# EAGLE design Ver4 (EAGLE 9.6.2)
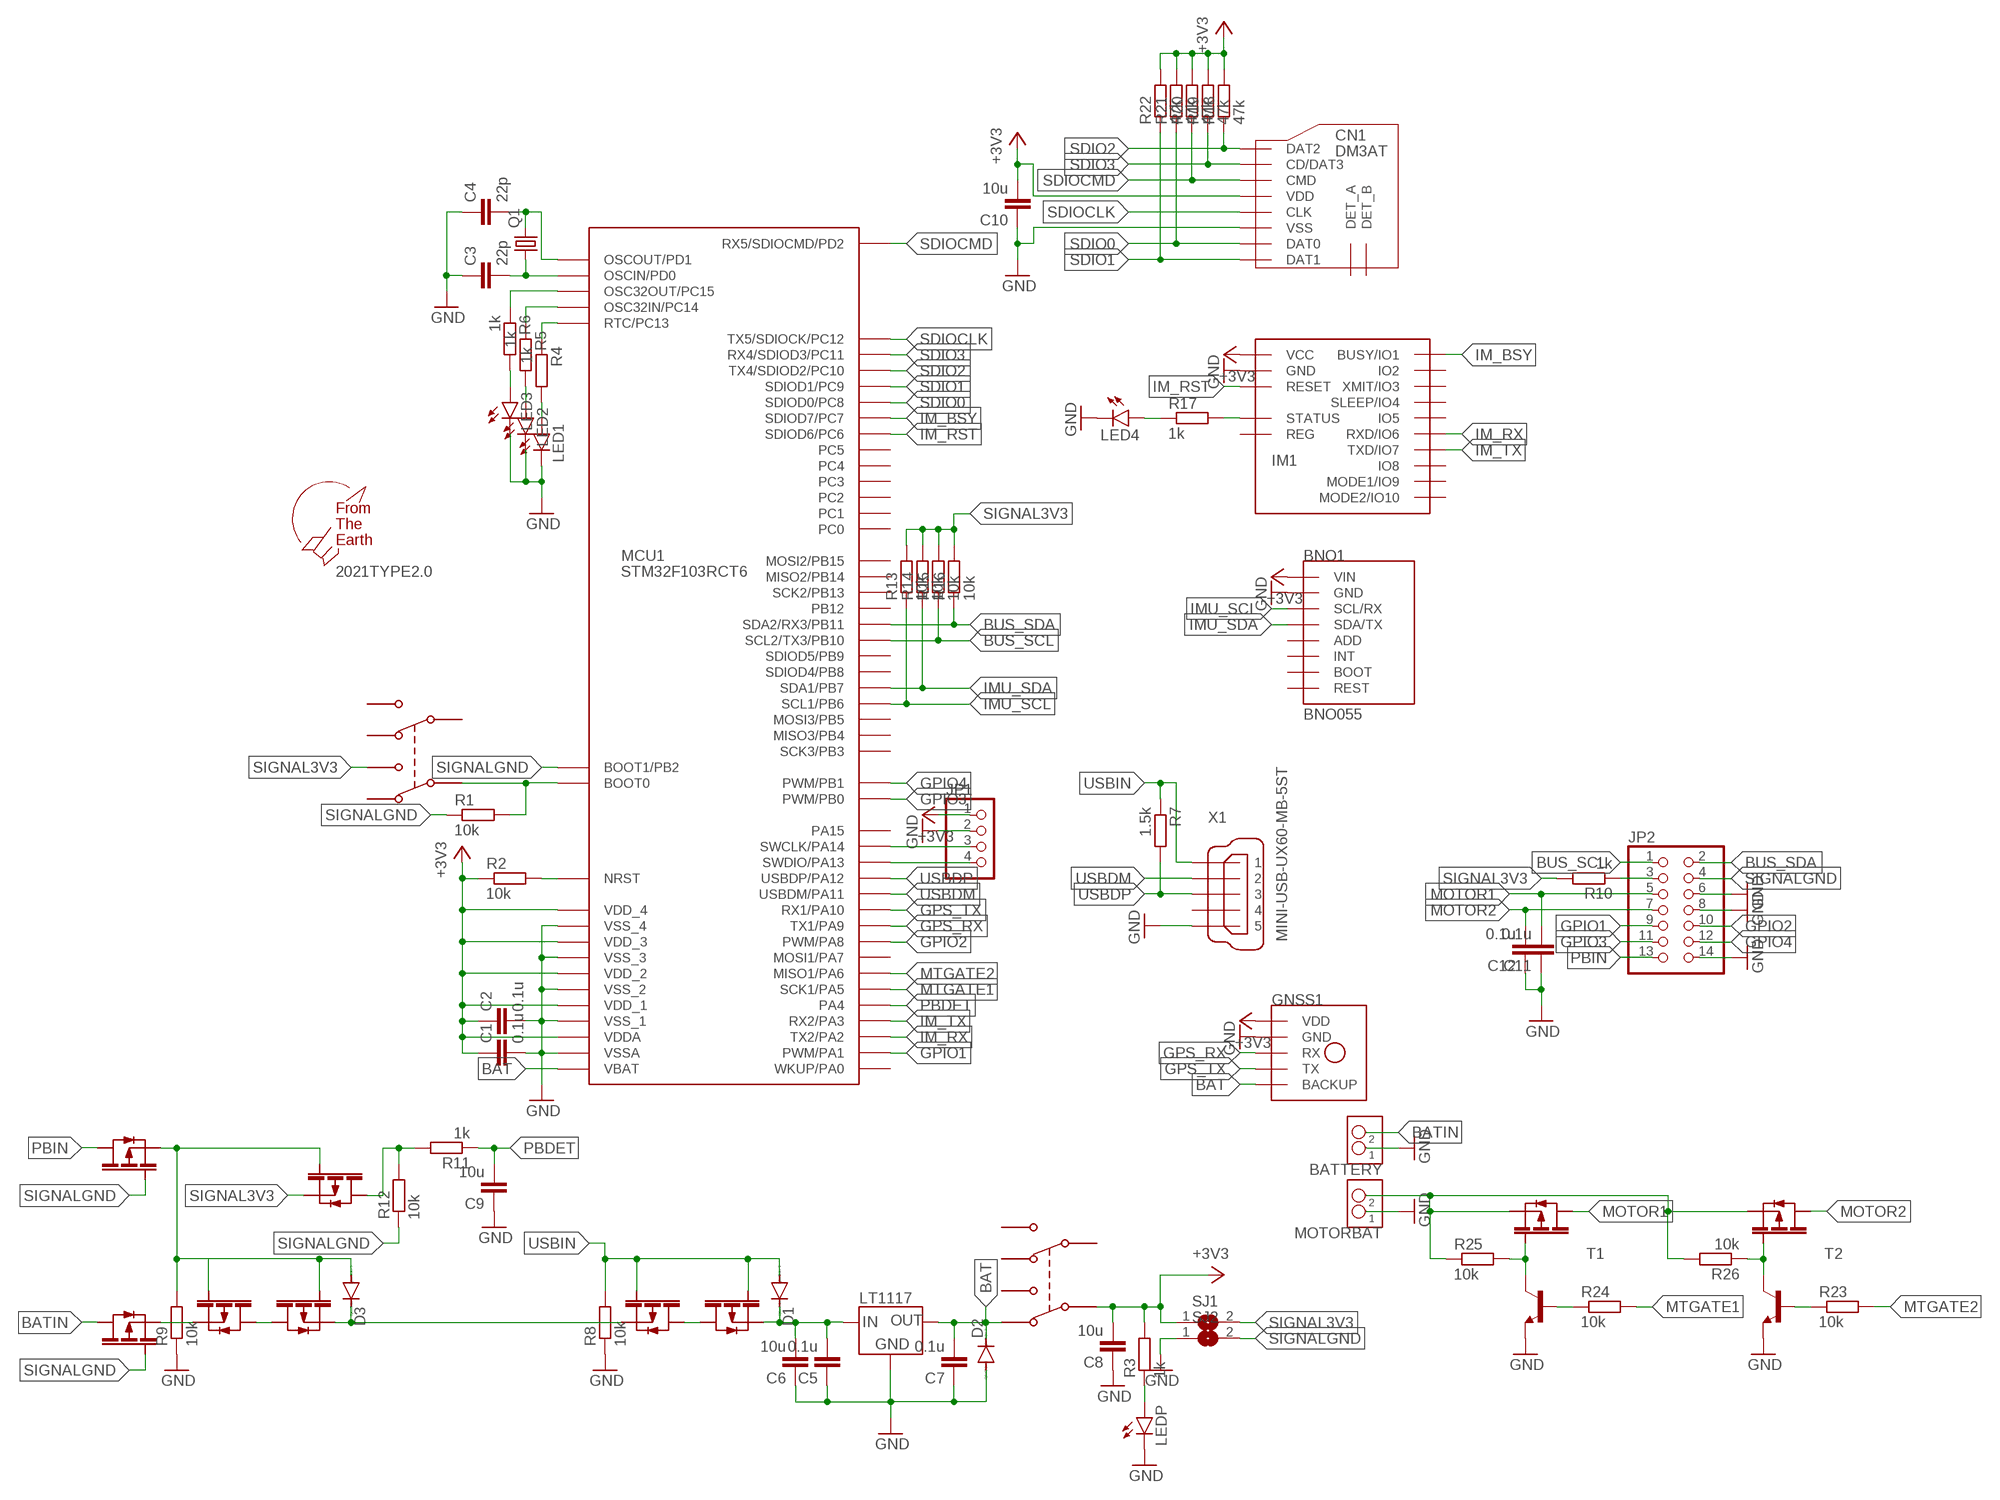
[diagram p0: schematic, sheet 1]

## Parts
2021TYPE2.0  F.T.E.LOGO  [LOGO]
BATTERY  S2B-XH-A  [S2B-XH-A]
BNO1  BNO055  [BNO055]
C1  0.1u  C-EUC1608  [C1608]
C2  0.1u  C-EUC1608  [C1608]
C3  22p  C-EUC1608  [C1608]
C4  22p  C-EUC1608  [C1608]
C5  0.1u  C-EUC1608  [C1608]
C6  10u  C-EUC1608  [C1608]
C7  0.1u  C-EUC1608  [C1608]
C8  10u  C-EUC1608  [C1608]
C9  10u  C-EUC1608  [C1608]
C10  10u  C-EUC1608  [C1608]
C11  0.1u  C-EUC1608  [C1608]
C12  0.1u  C-EUC1608  [C1608]
CN1  DM3AT  [DM3AT]
D1  DIODE-SOD123  [SOD123]
D2  DIODE-SOD123  [SOD123]
D3  DIODE-SOD123  [SOD123]
FET1  PCH  [SOT-23]
FET2  PCH  [SOT-23]
FET3  PCH  [SOT-23]
FET4  PCH  [SOT-23]
FET5  PCH  [SOT-23]
FET6  PCH  [SOT-23]
FET7  PCH  [SOT-23]
FET8  PCH  [SOT-23]
FET9  PCH  [SOT-23]
GNSS1  GYSFDMAXB  [GYSFDMAXB]
IC1  LT1117-3.3  [SOT-223]
IM1  IM920C  [IM920C]
JP1  PINHD-1X4/90  [1X04/90]
JP2  PINHD-2X7  [2X07]
LED1  LEDSML0805  [SML0805]
LED2  LEDSML0805  [SML0805]
LED3  LEDSML0805  [SML0805]
LED4  LEDSML0805  [SML0805]
LEDP  LEDSML0805  [SML0805]
MCU1  STM32F103RCT6  [LQFP64]
MOTORBAT  S2B-XH-A  [S2B-XH-A]
Q1  CRYSTALHC49S  [HC49/S]
R1  10k  R-EU_R0805  [R0805]
R2  10k  R-EU_R0805  [R0805]
R3  1k  R-EU_R0805  [R0805]
R4  1k  R-EU_R0805  [R0805]
R5  1k  R-EU_R0805  [R0805]
R6  1k  R-EU_R0805  [R0805]
R7  1.5k  R-EU_R0805  [R0805]
R8  10k  R-EU_R0805  [R0805]
R9  10k  R-EU_R0805  [R0805]
R10  1k  R-EU_R0805  [R0805]
R11  1k  R-EU_R0805  [R0805]
R12  10k  R-EU_R0805  [R0805]
R13  10k  R-EU_R0805  [R0805]
R14  10k  R-EU_R0805  [R0805]
R15  10k  R-EU_R0805  [R0805]
R16  10k  R-EU_R0805  [R0805]
R17  1k  R-EU_R0805  [R0805]
R18  47k  R-EU_R0805  [R0805]
R19  47k  R-EU_R0805  [R0805]
R20  47k  R-EU_R0805  [R0805]
R21  47k  R-EU_R0805  [R0805]
R22  47k  R-EU_R0805  [R0805]
R23  10k  R-EU_R0805  [R0805]
R24  10k  R-EU_R0805  [R0805]
R25  10k  R-EU_R0805  [R0805]
R26  10k  R-EU_R0805  [R0805]
SJ1  SJ  [SJ]
SJ2  SJ  [SJ]
T1  -NPN-SOT23-EBC  [SOT23-EBC]
T2  -NPN-SOT23-EBC  [SOT23-EBC]
U$1  MSS22D18  [MSS22D18]
U$2  MSS22D18  [MSS22D18]
X1  MINI-USB-UX60-MB-5ST  [UX60-MB-5ST]

## Nets
+3V3 [POWER_L]: BNO1.P1(VIN) C1.1 C2.1 C8.2 C10.2 CN1.VDD GNSS1.P$16(VDD) IM1.$P17(VCC) JP1.1 MCU1.P$13(VDDA) MCU1.P$19(VDD_4) MCU1.P$32(VDD_1) MCU1.P$48(VDD_2) MCU1.P$64(VDD_3) R2.1 R3.2 R18.2 R19.2 R20.2 R21.2 R22.2 SJ1.1 U$2.P$4
BAT [SIGNAL]: C7.2 D2.C GNSS1.P$14(BACKUP) IC1.1(OUT) IC1.2(OUT) MCU1.P$1(VBAT) U$2.P$3
BAT_FET_FET1 [POWER_L]: FET3.P$2 FET5.P$2
BAT_FET_FET2 [POWER_L]: FET3.P$3 FET4.P$3
BATIN [POWER_L]: BATTERY.P$2 FET5.P$3
BOOT0 [SIGNAL]: MCU1.P$60(BOOT0) R1.2 U$1.P$4
BUS_3V3 [SIGNAL]: JP2.3 R10.1
BUS_SCL [SIGNAL]: JP2.1 MCU1.P$29(SCL2/TX3/PB10) R15.1
BUS_SDA [SIGNAL]: JP2.2 MCU1.P$30(SDA2/RX3/PB11) R16.1
DIODE_FET [POWER_L]: D3.C FET1.P$2 FET4.P$2
FET_REG [POWER_L]: C5.2 C6.2 D1.C FET2.P$2 IC1.3(IN)
GND [POWER_L]: BATTERY.P$1 BNO1.P2(GND) C1.2 C2.2 C3.1 C4.1 C5.1 C6.1 C7.1 C8.1 C9.1 C10.1 C11.1 C12.1 CN1.VSS D2.A GNSS1.P$1(GND) GNSS1.P$2(GND) GNSS1.P$7(GND) GNSS1.P$10(GND) GNSS1.P$12(GND) GNSS1.P$19(GND) GNSS1.P$20(GND) IC1.4(GND) IM1.$P18(GND) JP1.2 JP2.6 JP2.8 JP2.14 LED1.C LED2.C LED3.C LED4.C LEDP.C MCU1.P$12(VSSA) MCU1.P$18(VSS_4) MCU1.P$31(VSS_1) MCU1.P$47(VSS_2) MCU1.P$63(VSS_3) MOTORBAT.P$1 R8.1 R9.1 SJ2.1 T2.E X1.5
GPIO1 [GPIO]: JP2.9 MCU1.P$15(PWM/PA1)
GPIO2 [GPIO]: JP2.10 MCU1.P$41(PWM/PA8)
GPIO3 [GPIO]: JP2.11 MCU1.P$26(PWM/PB0)
GPIO4 [GPIO]: JP2.12 MCU1.P$27(PWM/PB1)
GPS_RX [SIGNAL]: GNSS1.P$3(RX) MCU1.P$42(TX1/PA9)
GPS_TX [SIGNAL]: GNSS1.P$5(TX) MCU1.P$43(RX1/PA10)
IM_BSY [SIGNAL]: IM1.$P1(BUSY/IO1) MCU1.P$38(SDIOD7/PC7)
IM_RST [SIGNAL]: IM1.$P19(RESET) MCU1.P$37(SDIOD6/PC6)
IM_RX [SIGNAL]: IM1.$P6(RXD/IO6) MCU1.P$16(TX2/PA2)
IM_ST_R [GPIO]: IM1.$P15(STATUS) R17.2
IM_TX [SIGNAL]: IM1.$P7(TXD/IO7) MCU1.P$17(RX2/PA3)
IMU_SCL [SIGNAL]: BNO1.P3(SCL/RX) MCU1.P$58(SCL1/PB6) R13.1
IMU_SDA [SIGNAL]: BNO1.P4(SDA/TX) MCU1.P$59(SDA1/PB7) R14.1
MOTOR1 [POWER_H]: C11.2 FET9.P$3 JP2.5
MOTOR2 [POWER_H]: C12.2 FET8.P$3 JP2.7
MTBATIN [POWER_H]: FET8.P$2 FET9.P$2 MOTORBAT.P$2 R25.1 R26.2
MTGATE1 [SIGNAL]: MCU1.P$21(SCK1/PA5) R24.2
MTGATE2 [SIGNAL]: MCU1.P$22(MISO1/PA6) R23.2
NRST [SIGNAL]: MCU1.P$7(NRST) R2.2
OSCIN [SIGNAL]: C3.2 MCU1.P$5(OSCIN/PD0) Q1.1
OSCOUT [SIGNAL]: C4.2 MCU1.P$6(OSCOUT/PD1) Q1.2
PB_FET_DIODE [POWER_L]: D3.A FET3.P$1 FET4.P$1 FET6.P$2 FET7.P$1 R9.2
PBDET [SIGNAL]: C9.2 MCU1.P$20(PA4) R11.1
PBDET_FET_R [SIGNAL]: FET7.P$3 R11.2 R12.2
PBIN [POWER_L]: FET6.P$3 JP2.13
PC13_R [GPIO]: MCU1.P$2(RTC/PC13) R4.1
PC14_R [GPIO]: MCU1.P$3(OSC32IN/PC14) R5.1
PC15_R [GPIO]: MCU1.P$4(OSC32OUT/PC15) R6.1
R_LED1 [GPIO]: LED1.A R4.2
R_LED2 [GPIO]: LED2.A R5.2
R_LED3 [GPIO]: LED3.A R6.2
R_LED4 [GPIO]: LED4.A R17.1
R_LEDP [GPIO]: LEDP.A R3.1
R_T1 [SIGNAL]: FET9.P$1 R25.2 T1.C T1.E ; supply symbol labelled GND
R_T2 [SIGNAL]: FET8.P$1 R26.1 T2.C
SDIO0 [SDIO]: CN1.DAT0 MCU1.P$39(SDIOD0/PC8) R21.1
SDIO1 [SDIO]: CN1.DAT1 MCU1.P$40(SDIOD1/PC9) R22.1
SDIO2 [SDIO]: CN1.DAT2 MCU1.P$51(TX4/SDIOD2/PC10) R18.1
SDIO3 [SDIO]: CN1.CD/DAT3 MCU1.P$52(RX4/SDIOD3/PC11) R19.1
SDIOCLK [SDIO]: CN1.CLK MCU1.P$53(TX5/SDIOCK/PC12)
SDIOCMD [SDIO]: CN1.CMD MCU1.P$54(RX5/SDIOCMD/PD2) R20.1
SIGNAL3V3 [SIGNAL]: FET7.P$2 R10.2 R13.2 R14.2 R15.2 R16.2 SJ1.2 U$1.P$5
SIGNALGND [SIGNAL]: FET5.P$1 FET6.P$1 JP2.4 MCU1.P$28(BOOT1/PB2) R1.1 R12.1 SJ2.2
SWCLK [SIGNAL]: JP1.3 MCU1.P$49(SWCLK/PA14)
SWDIO [SIGNAL]: JP1.4 MCU1.P$46(SWDIO/PA13)
T1_BASE [SIGNAL]: R24.1 T1.B
T2_BASE [SIGNAL]: R23.1 T2.B
USB_FET_FET [POWER_L]: FET1.P$3 FET2.P$3
USBDM [SIGNAL]: MCU1.P$44(USBDM/PA11) X1.2
USBDP [SIGNAL]: MCU1.P$45(USBDP/PA12) R7.2 X1.3
USBIN [POWER_L]: D1.A FET1.P$1 FET2.P$1 R7.1 R8.2 X1.1
Unconnected: BNO1.P5(ADD) BNO1.P6(INT) BNO1.P7(BOOT) BNO1.P8(REST) CN1.DET_A CN1.DET_B IM1.$P2(IO2) IM1.$P3(XMIT/IO3) IM1.$P4(SLEEP/IO4) IM1.$P5(IO5) IM1.$P8(IO8) IM1.$P9(MODE1/IO9) IM1.$P10(MODE2/IO10) IM1.$P16(REG) MCU1.P$8(PC0) MCU1.P$9(PC1) MCU1.P$10(PC2) MCU1.P$11(PC3) MCU1.P$14(WKUP/PA0) MCU1.P$23(MOSI1/PA7) MCU1.P$24(PC4) MCU1.P$25(PC5) MCU1.P$33(PB12) MCU1.P$34(SCK2/PB13) MCU1.P$35(MISO2/PB14) MCU1.P$36(MOSI2/PB15) MCU1.P$50(PA15) MCU1.P$55(SCK3/PB3) MCU1.P$56(MISO3/PB4) MCU1.P$57(MOSI3/PB5) MCU1.P$61(SDIOD4/PB8) MCU1.P$62(SDIOD5/PB9) U$1.P$0 U$1.P$1 U$1.P$2 U$1.P$3 U$2.P$0 U$2.P$1 U$2.P$2 U$2.P$5 X1.4

## Library data of the parts
2021TYPE2.0 = logo:F.T.E.LOGO
BATTERY MOTORBAT = JST-Con:S2B-XH-A
BNO1 = BNO055:BNO055
C1-C12 = rcl:C-EU: CAPACITOR, European symbol; SPICEPREFIX: C
CN1 = microSD:DM3AT
D1-D3 = diode:DIODE-: DIODE
FET1-FET9 = MOSFET:PCH
GNSS1 = GYSFDMAXB:GYSFDMAXB
IC1 = LT1117:LT1117-3.3
IM1 = IM920:IM920C
JP1 = pinhead:PINHD-1X4: PIN HEADER
JP2 = pinhead:PINHD-2X7: PIN HEADER
LED1-LED4 LEDP = led:LED: LED OSRAM: - CHIPLED LG R971, LG N971, LY N971, LG Q971, LY Q971, LO R971, LY R971 LH N974, LH R974 LS Q976, LO Q976, LY Q976 LO Q996 - Hyper CHIPLED LW Q18S LB Q993, LB Q99A, LB R99A - SideLED LS A670, LO A670, LY A670, LG A670, LP A670 LB A673, LV A673, LT A673, LW A673 LH A674 LY A675 LS A676, LA A676, LO A676, LY A676, LW A676 LS A679, LY A679, LG A679 - Hyper Micro SIDELED® LS Y876, LA Y876, LO Y876, LY Y876 LT Y87S - SmartLED LW L88C, LW L88S LB L89C, LB L89S, LG L890 LS L89K, LO L89K, LY L89K LS L896, LA L896, LO L896, LY L896 - TOPLED LS T670, LO T670, LY T670, LG T670, LP T670 LSG T670, LSP T670, LSY T670, LOP T670, LYG T670 LG T671, LOG T671, LSG T671 LB T673, LV T673, LT T673, LW T673 LH T674 LS T676, LA T676, LO T676, LY T676, LB T676, LH T676, LSB T676, LW T676 LB T67C, LV T67C, LT T67C, LS T67K, LO T67K, LY T67K, LW E67C LS E67B, LA E67B, LO E67B, LY E67B, LB E67C, LV E67C, LT E67C LW T67C LS T679, LY T679, LG T679 LS T770, LO T770, LY T770, LG T770, LP T770 LB T773, LV T773, LT T773, LW T773 LH T774 LS E675, LA E675, LY E675, LS T675 LS T776, LA T776, LO T776, LY T776, LB T776 LHGB T686 LT T68C, LB T68C - Hyper Mini TOPLED® LB M676 - Mini TOPLED Santana® LG M470 LS M47K, LO M47K, LY M47K Source: http://www.osram.convergy.de LUXEON: - LUMILED® LXK2-PW12-R00, LXK2-PW12-S00, LXK2-PW14-U00, LXK2-PW14-V00 LXK2-PM12-R00, LXK2-PM12-S00, LXK2-PM14-U00 LXK2-PE12-Q00, LXK2-PE12-R00, LXK2-PE12-S00, LXK2-PE14-T00, LXK2-PE14-U00 LXK2-PB12-K00, LXK2-PB12-L00, LXK2-PB12-M00, LXK2-PB14-N00, LXK2-PB14-P00, LXK2-PB14-Q00 LXK2-PR12-L00, LXK2-PR12-M00, LXK2-PR14-Q00, LXK2-PR14-R00 LXK2-PD12-Q00, LXK2-PD12-R00, LXK2-PD12-S00 LXK2-PH12-R00, LXK2-PH12-S00 LXK2-PL12-P00, LXK2-PL12-Q00, LXK2-PL12-R00 Source: www.luxeon.com KINGBRIGHT: KA-3528ASYC Source: www.kingbright.com
MCU1 = STM32F103:STM32F103RCT6
Q1 = crystal:CRYSTAL: CRYSTAL; OC_FARNELL: 1667008; OC_NEWARK: unknown
R1-R26 = rcl:R-EU_: RESISTOR, European symbol; SPICEPREFIX: R
SJ1 SJ2 = jumper:SJ: SMD solder JUMPER
T1 T2 = transistor:*-NPN-: NPN Transistror BF959 corrected 2008.03.06
U$1 U$2 = switch_slide:MSS22D18
X1 = con-hirose:MINI-USB-: MINI USB Connector Source: http://www.hirose.co.jp/cataloge_hp/e24000019.pdf; OC_FARNELL: unknown; OC_NEWARK: unknown

## Net classes
1 SDIO: width 0.152 mm, drill 0.305 mm, clearance 0.152 mm
2 SIGNAL: width 0.152 mm, drill 0.305 mm, clearance 0.152 mm to class 1, clearance 0.152 mm
3 POWER_L: width 0.229 mm, drill 0.305 mm, clearance 0.305 mm to class 1, clearance 0.152 mm to class 2, clearance 0.152 mm
4 GPIO: width 0.229 mm, drill 0.305 mm, clearance 0.152 mm to class 1, clearance 0.152 mm to class 2, clearance 0.152 mm to class 3, clearance 0.152 mm
5 POWER_H: width 0.457 mm, drill 0.305 mm, clearance 0.305 mm to class 1, clearance 0.305 mm to class 2, clearance 0.305 mm to class 3, clearance 0.305 mm to class 4, clearance 0.305 mm

## Board
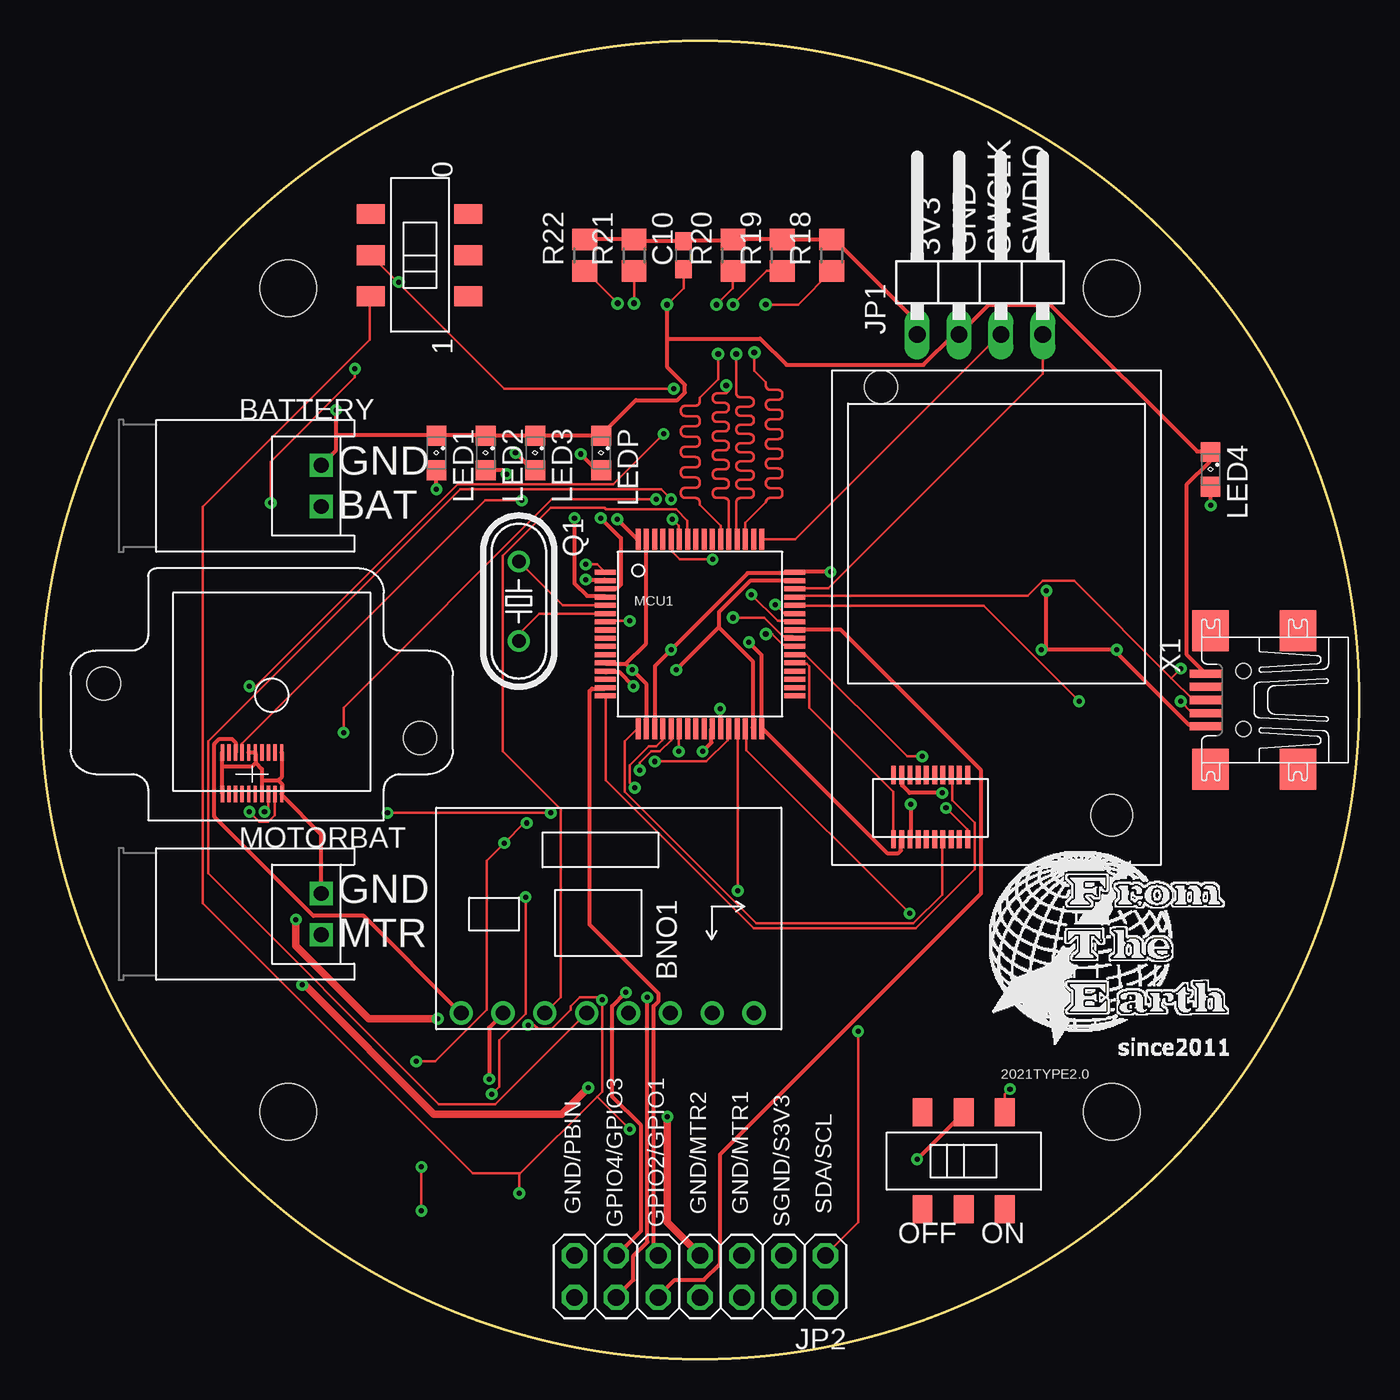
[diagram p1: board, top side]
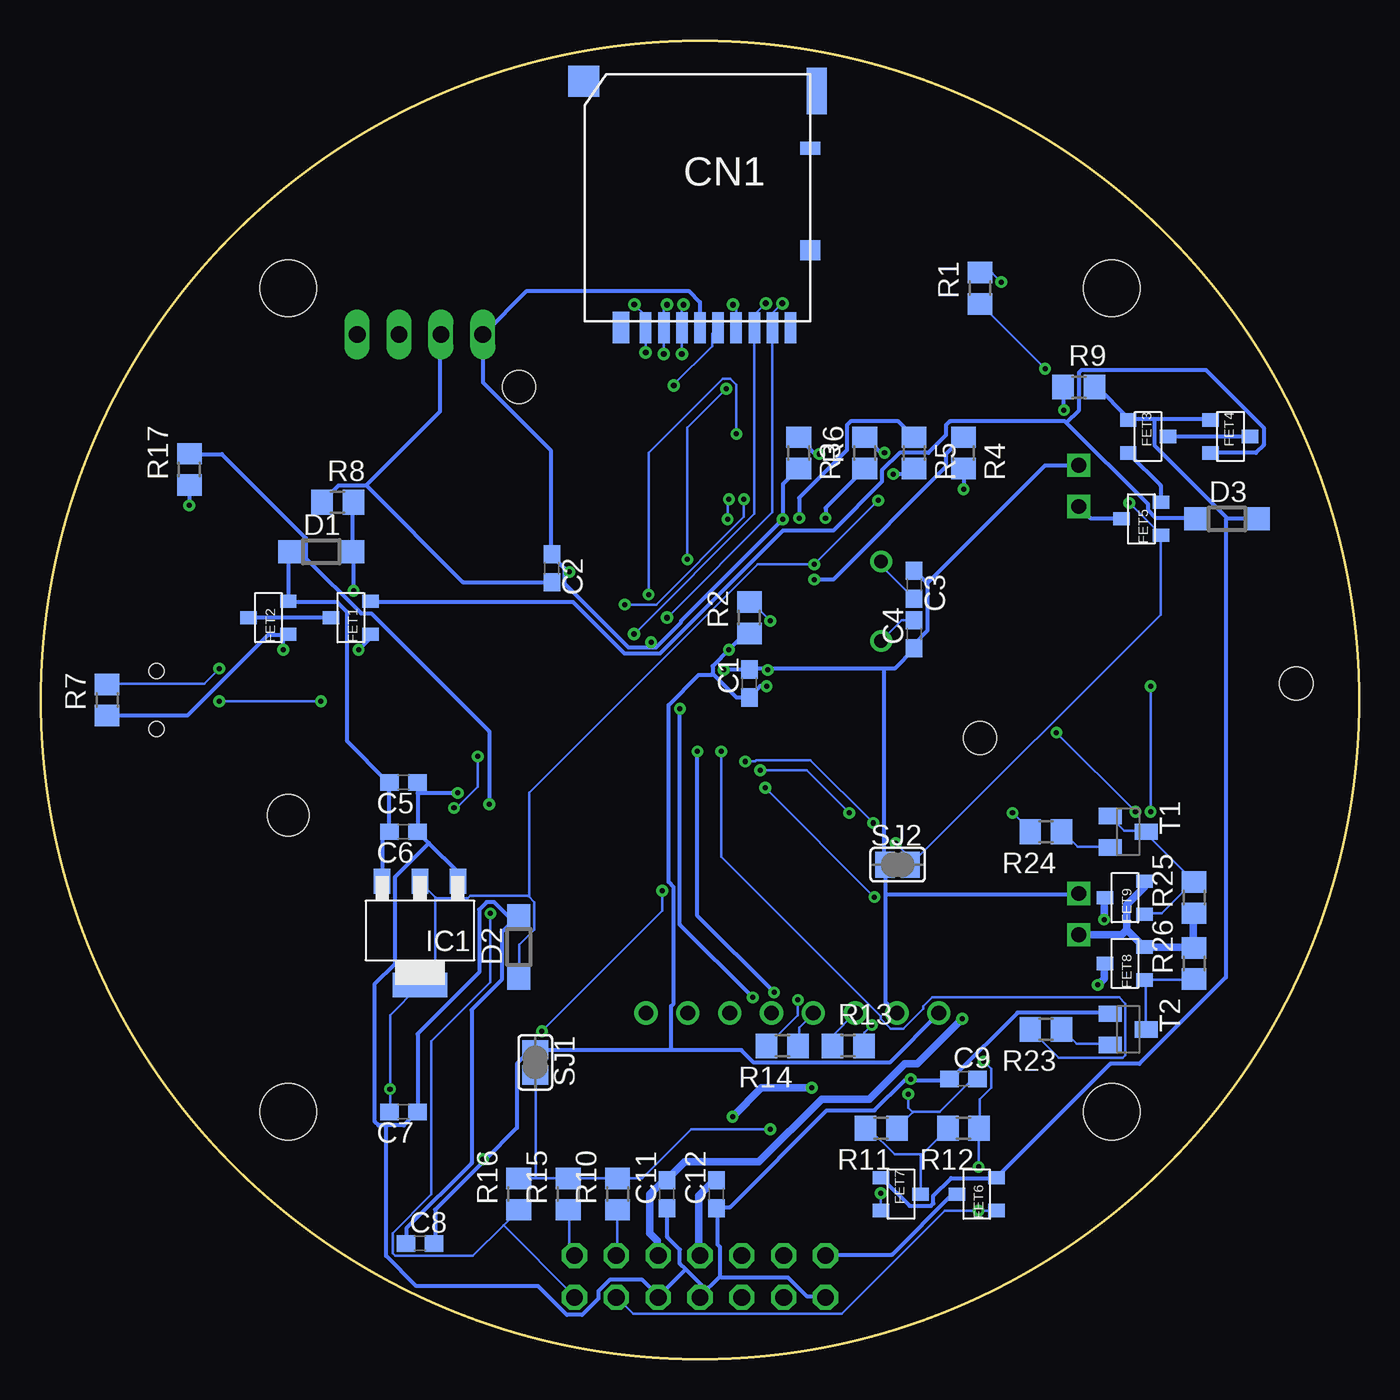
[diagram p2: board, bottom side, seen from below]

Size 80 x 80 mm. Coordinates in mm from the lower left corner, seen from the top.
Outline: circle at 40,40 radius 40
Copper layers (1*16): Top 0.035mm / dielectric 1.5mm / Bottom 0.035mm
Design rules "PCBGoGo": minimum track width 6mil, minimum drill 0.2mm, track to track 6mil, track to pad 6mil, pad to pad 6mil, via to via 6mil, smd to smd 6mil, copper to edge 0.2mm, drill to drill 6mil, minimum pad ring 10mil, minimum via ring 8mil, stop-mask expansion 4mil, vias tented up to drill 0mil, thermal gap 10mil
Holes 3.4 mm at 15,15 65,15 65,65 15,65

### Footprints (pad centres in the part's own frame; a part is rotated, then mirrored left to right if it is on the bottom)
S2B-XH-A = drill 0.9 square: P$1 0,1.25; P$2 0,-1.25
BNO055 = drill 0.9: P1 -7,11.5; P2 -7,8.96; P3 -7,6.42; P4 -7,3.88; P5 -7,1.34; P6 -7,-1.2; P7 -7,-3.74; P8 -7,-6.28
C1608 = smd 1.1 x 1: 1 -0.85,0; 2 0.85,0
DM3AT = smd 0.7 x 1.9: CD/DAT3 2.2,6.4; CLK -1.1,6.4; CMD 1.1,6.4; DAT0 -3.3,6.4; DAT1 -4.4,6.4; DAT2 3.3,6.4; DET_B -5.5,6.4; VDD 0,6.4; VSS -2.2,6.4 | smd 1.2 x 0.8: DET_A -6.7,-4.5 | smd 1 x 1.9: P$9 4.8,6.381 | smd 1.2 x 1.2: P$11 -6.7,1.7 | smd 1.2 x 2.8: P$13 -7.081,-7.973 | smd 1.9 x 1.9: P$14 7.054,-8.562
SOD123 = smd 1.4 x 1.4: A 1.9,0; C -1.9,0
SOT-23 = smd 0.8 x 1: P$1 -1,0; P$2 1,0; P$3 0,2.4
GYSFDMAXB = smd 0.2 x 1: P$1 8.4,6.7; P$2 8.4,4.2; P$3 8.8,6.7; P$4 8.8,4.2; P$5 9.2,6.7; P$6 9.2,4.2; P$7 9.6,6.7; P$8 9.6,4.2; P$9 10,6.7; P$10 10,4.2; P$11 10.4,6.7; P$12 10.4,4.2; P$13 10.8,6.7; P$14 10.8,4.2; P$15 11.2,6.7; P$16 11.2,4.2; P$17 11.6,6.7; P$18 11.6,4.2; P$19 12,6.7; P$20 12,4.2 | hole 2: 0,3.3; 19.2,0
SOT-223 = smd 3.3 x 1.5: 1 0,3.3 | smd 1 x 1.5: 2 0,-3; 3 2.3,-3; 4 -2.3,-3
IM920C = smd 0.3 x 1.1: $P1 -1.75,-13.45; $P2 -1.75,-9.55; $P3 -2.25,-13.45; $P4 -2.25,-9.55; $P5 -2.75,-13.45; $P6 -2.75,-9.55; $P7 -3.25,-13.45; $P8 -3.25,-9.55; $P9 -3.75,-13.45; $P10 -3.75,-9.55; $P11 -4.25,-13.45; $P12 -4.25,-9.55; $P13 -4.75,-13.45; $P14 -4.75,-9.55; $P15 -5.25,-13.45; $P16 -5.25,-9.55; $P17 -5.75,-13.45; $P18 -5.75,-9.55; $P19 -6.25,-13.45; $P20 -6.25,-9.55 | hole 2.5: 7,-12 | hole 2: -7,14
1X04/90 = drill 1.016 long: 1 -3.81,-3.81; 2 -1.27,-3.81; 3 1.27,-3.81; 4 3.81,-3.81
2X07 = drill 1.016 octagon: 1 -7.62,-1.27; 2 -7.62,1.27; 3 -5.08,-1.27; 4 -5.08,1.27; 5 -2.54,-1.27; 6 -2.54,1.27; 7 0,-1.27; 8 0,1.27; 9 2.54,-1.27; 10 2.54,1.27; 11 5.08,-1.27; 12 5.08,1.27; 13 7.62,-1.27; 14 7.62,1.27
SML0805 = smd 1.2 x 1.2: A 1.05,0; C -1.05,0
LQFP64 = smd 1.27 x 0.305: P$1 -5.75,3.75; P$2 -5.75,3.25; P$3 -5.75,2.75; P$4 -5.75,2.25; P$5 -5.75,1.75; P$6 -5.75,1.25; P$7 -5.75,0.75; P$8 -5.75,0.25; P$9 -5.75,-0.25; P$10 -5.75,-0.75; P$11 -5.75,-1.25; P$12 -5.75,-1.75; P$13 -5.75,-2.25; P$14 -5.75,-2.75; P$15 -5.75,-3.25; P$16 -5.75,-3.75; P$33 5.75,-3.75; P$34 5.75,-3.25; P$35 5.75,-2.75; P$36 5.75,-2.25; P$37 5.75,-1.75; P$38 5.75,-1.25; P$39 5.75,-0.75; P$40 5.75,-0.25; P$41 5.75,0.25; P$42 5.75,0.75; P$43 5.75,1.25; P$44 5.75,1.75; P$45 5.75,2.25; P$46 5.75,2.75; P$47 5.75,3.25; P$48 5.75,3.75 | smd 0.305 x 1.27: P$17 -3.75,-5.75; P$18 -3.25,-5.75; P$19 -2.75,-5.75; P$20 -2.25,-5.75; P$21 -1.75,-5.75; P$22 -1.25,-5.75; P$23 -0.75,-5.75; P$24 -0.25,-5.75; P$25 0.25,-5.75; P$26 0.75,-5.75; P$27 1.25,-5.75; P$28 1.75,-5.75; P$29 2.25,-5.75; P$30 2.75,-5.75; P$31 3.25,-5.75; P$32 3.75,-5.75; P$49 3.75,5.75; P$50 3.25,5.75; P$51 2.75,5.75; P$52 2.25,5.75; P$53 1.75,5.75; P$54 1.25,5.75; P$55 0.75,5.75; P$56 0.25,5.75; P$57 -0.25,5.75; P$58 -0.75,5.75; P$59 -1.25,5.75; P$60 -1.75,5.75; P$61 -2.25,5.75; P$62 -2.75,5.75; P$63 -3.25,5.75; P$64 -3.75,5.75
HC49/S = drill 0.813: 1 -2.413,0; 2 2.413,0
R0805 = smd 1.3 x 1.5: 1 -0.95,0; 2 0.95,0
SJ = smd 1.168 x 1.6: 1 -0.762,0; 2 0.762,0
SOT23-EBC = smd 1 x 1.4: B 0.95,-1.1; C 0,1.1; E -0.95,-1.1
MSS22D18 = smd 1.2 x 1.7: P$0 -2.492,-2.923; P$1 0.008,-2.923; P$2 2.508,-2.923; P$3 2.508,2.977; P$4 0.008,2.977; P$5 -2.492,2.977
UX60-MB-5ST = smd 2 x 0.5: 1 2.25,1.6; 2 2.25,0.8; 3 2.25,0; 4 2.25,-0.8; 5 2.25,-1.6 | smd 2.2 x 2.5: M1 -3.3,-4.2; M2 -3.3,4.2; M3 2,4.2; M4 2,-4.2 | hole 0.9: 0,-1.75; 0,1.75

### Placement (x,y rotation side)
2021TYPE2.0  57,17 0 top
BATTERY  17,53 0 top
BNO1  37,28 90 top
C1  37,41 90 bottom
C2  49,48 270 bottom
C3  27,47 270 bottom
C4  27,44 90 bottom
C5  58,35 180 bottom
C6  58,32 180 bottom
C7  58,15 180 bottom
C8  57,7 0 bottom
C9  24,17 0 bottom
C10  39,67 90 top
C11  42,10 90 bottom
C12  39,10 90 bottom
CN1  40,69 180 bottom
D1  63,49 0 bottom
D2  51,25 90 bottom
D3  8,51 0 bottom
FET1  60,45 90 bottom
FET2  65,45 90 bottom
FET3  14,56 270 bottom
FET4  9,56 270 bottom
FET5  12,51 90 bottom
FET6  22,10 90 bottom
FET7  29,10 270 bottom
FET8  13,24 90 bottom
FET9  13,28 90 bottom
GNSS1  23,41 180 top
IC1  57,26 180 bottom
IM1  58,45 0 top
JP1  57,66 0 top
JP2  40,5 180 top
LED1  24,55 270 top
LED2  27,55 270 top
LED3  30,55 270 top
LED4  71,54 270 top
LEDP  34,55 270 top
MCU1  40,44 0 top
MOTORBAT  17,27 0 top
Q1  29,46 270 top
R1  23,65 90 bottom
R2  37,45 90 bottom
R3  34,55 270 bottom
R4  24,55 270 bottom
R5  27,55 270 bottom
R6  30,55 90 bottom
R7  76,40 90 bottom
R8  62,52 0 bottom
R9  17,59 0 bottom
R10  45,10 90 bottom
R11  29,14 180 bottom
R12  24,14 180 bottom
R13  31,19 0 bottom
R14  35,19 180 bottom
R15  48,10 90 bottom
R16  51,10 90 bottom
R17  71,54 90 bottom
R18  48,67 90 top
R19  45,67 90 top
R20  42,67 90 top
R21  36,67 90 top
R22  33,67 90 top
R23  19,20 180 bottom
R24  19,32 180 bottom
R25  10,28 90 bottom
R26  10,24 90 bottom
SJ1  50,18 270 bottom
SJ2  28,30 0 bottom
T1  14,32 270 bottom
T2  14,20 270 bottom
U$1  23,67 90 top
U$2  56,12 0 top
X1  73,40 180 top

### Tracks (layer width: path | path; a pad name or v marks a point on that pad's centre or on a via)
+3V3  (via drill 0.3)
  Top 0.229: v35.96,40.84 35.12,41.68 34.28,41.68 MCU1.P$13 | MCU1.P$19 37.26,38.32 37.26,42.06 v38.25,43.05 42.9,47.7 45.72,47.7 MCU1.P$48 45.79,47.77 v47.92,47.77 | R22.2 33.07,67.97 35.96,67.97 R21.2 36.04,67.89 38.93,67.89 C10.2 39.09,67.89 41.91,67.89 R20.2 42.06,67.97 44.95,67.97 R19.2 45.11,67.97 47.92,67.97 R18.2 48.08,67.89 48.23,67.89 53.18,62.94 53.18,62.25 JP1.1 | IM1.$P17 52.19,31.54 52.19,30.86 52.04,30.7 51.35,30.7 43.81,38.25 MCU1.P$32 43.73,38.32 43.73,42.74 v42.97,43.51 | v34.97,50.97 36.19,49.75 MCU1.P$64 | v53.18,12.11 56,14.93 U$2.P$4 | GNSS1.P$16 11.81,36.88 11.81,37.41 11.58,37.64 10.82,37.64 10.51,37.33 10.51,32.91 16.53,26.89 19.58,26.89 25.45,21.03 BNO1.P1
  Bottom 0.229: 39.24,41.6 37.79,40.15 37.03,40.15 C1.1 36.95,40.23 36.34,40.84 v35.96,40.84 | 39.24,41.6 39.24,42.06 v38.25,43.05 37.26,44.04 37.03,44.04 R2.1 | R3.2 34.06,54.02 34.97,53.11 v34.97,50.97 41.14,44.8 41.14,44.72 42.67,43.2 42.97,43.2 | CN1.VDD 40,64.16 40.69,64.84 50.52,64.84 53.11,62.25 JP1.1 53.18,62.17 53.18,59.28 49.07,55.16 49.07,48.91 C2.1 48.99,48.76 48.23,48 48.23,47.77 | 42.97,43.2 44.34,43.2 48.23,47.09 48.23,47.77 | 42.97,43.2 v42.97,43.51 | 48.23,47.77 v47.92,47.77 | 53.11,12.04 51.12,14.02 51.12,17.9 50.29,18.74 50.06,18.74 SJ1.1 49.91,18.74 41.75,18.74 | 53.11,12.04 56.08,9.06 56.08,7.01 C8.2 | v53.18,12.11 53.11,12.04 | 41.75,18.74 37.48,18.74 36.72,17.98 28.49,17.98 25.52,20.95 BNO1.P1 | 41.75,18.74 41.75,21.41 41.6,21.56 41.6,28.65 41.91,28.95 41.91,39.7 40.08,41.52 39.31,41.52 39.24,41.6
BAT  (via drill 0.3)
  Top 0.152: v58.82,16.38 58.52,16.07 58.52,15.01 U$2.P$3 | v29.18,52.12 26.97,52.12 12.19,37.33 12.19,36.88 GNSS1.P$14 | v33.07,48.23 33.75,48.23 34.21,47.77 MCU1.P$1
  Bottom 0.152: 50.4,28.07 50.44,28.11 53.95,28.11 54.1,27.96 56,27.96 56.04,28 | 50.4,28.07 50.06,27.73 50.06,26.05 50.97,25.14 50.97,23.16 D2.C | 56.04,28 56.99,28.95 IC1.2 | C7.2 58.82,15.01 v58.82,16.38 58.82,20.87 57.07,22.63 IC1.1 56.08,23.62 56.08,27.96 56.04,28 | v29.18,52.12 v33.07,48.23 36.49,48.23 50.36,34.36 50.36,28.11 50.4,28.07
BAT_FET_FET1
  Bottom 0.229: FET5.P$2 12.04,52.04 12.04,53.03 13.94,54.94 FET3.P$2
BAT_FET_FET2
  Bottom 0.229: FET4.P$3 6.62,56 11.58,56 FET3.P$3
BATIN
  Bottom 0.229: FET5.P$3 14.47,51.05 16.3,51.05 16.99,51.73 BATTERY.P$2
BOOT0  (via drill 0.3)
  Top 0.152: v40.76,48.53 38.78,48.53 38.32,48.99 38.32,49.68 MCU1.P$60 | v38.4,58.9 28.11,58.9 21.67,65.34 | 21.67,65.34 20.04,66.97 U$1.P$4 | v21.71,65.38 21.67,65.34
  Bottom 0.152: v40.76,48.53 40.76,56.53 v38.4,58.9 | v21.71,65.38 22.25,65.91 22.93,65.91 R1.2
BUS_3V3
  Bottom 0.152: R10.1 45.03,8.99 45.03,6.32 JP2.3
BUS_SCL  (via drill 0.3)
  Top 0.152: v42.29,28.42 42.29,38.25 MCU1.P$29 | v49.6,19.88 49.6,8.3 47.62,6.32 JP2.1
  Bottom 0.152: v42.29,28.42 42.29,27.2 v49.6,19.88 | R15.1 47.92,8.99 47.92,6.62 47.62,6.32 JP2.1
BUS_SDA  (via drill 0.3)
  Top 0.152: v52.73,27.05 42.82,36.95 42.82,38.25 MCU1.P$30
  Bottom 0.152: v52.73,27.05 52.73,22.86 56.31,19.27 56.31,9.98 58.67,7.62 58.67,6.4 58.52,6.24 53.79,6.24 51.92,8.11 | 51.92,8.11 51.05,8.99 R16.1 | 51.92,8.11 47.62,3.8 JP2.2
DIODE_FET
  Bottom 0.229: 17.75,56.84 12.8,51.89 12.8,51.51 12.34,51.05 9.9,51.05 D3.C | 17.75,56.84 17.83,56.92 24.84,56.92 25.06,56.69 25.06,56.08 26.13,55.01 27.88,55.01 28.95,53.95 28.95,53.26 31.92,50.29 34.97,50.29 42.44,42.82 44.57,42.82 47.7,45.94 59.96,45.94 FET1.P$2 | 17.75,56.84 16.99,57.6 16.99,59.89 16.84,60.04 9.29,60.04 5.79,56.53 5.79,55.47 6.24,55.01 8.99,55.01 FET4.P$2
FET_REG
  Bottom 0.229: D1.C 64.92,48.99 64.99,48.91 64.99,46.02 FET2.P$2 64.92,45.94 62.02,45.94 61.41,45.33 61.41,37.48 58.97,35.05 C5.2 58.9,34.97 58.9,32.08 C6.2 58.9,31.92 59.28,31.54 59.28,29.03 IC1.3
GND  (via drill 0.3, 0.35)
  Top 0.152: v38,64 39,65 C10.1
  Top 0.229: v54.71,34.36 52.73,34.36 52.27,34.82 52.27,35.43 IM1.$P18 | X1.5 70.71,41.6 69.57,42.74 69.57,53.11 70.94,54.48 70.94,55.01 LED4.C 70.86,55.09 70.17,55.09 61.26,64 57.53,64 55.77,62.25 JP1.2 55.62,62.17 55.39,62.17 53.56,60.34 45.26,60.34 43.66,61.95 38.02,61.95 | 17.9,56.08 17.9,55.16 17.06,54.33 BATTERY.P$1 | 17.9,56.08 v17.9,57.6 | 38.02,61.95 38.02,60.19 39.09,59.13 39.09,58.67 38.63,58.21 36.11,58.21 34.06,56.15 LEDP.C 33.98,56.08 30.09,56.08 LED3.C 29.94,56.08 27.05,56.08 LED2.C 26.97,56.08 24.07,56.08 LED1.C 23.92,56.08 17.9,56.08 | 38.02,61.95 38.02,63.93 v38,64 | 35.5,42.21 v35.88,41.83 36.72,40.99 36.72,38.32 MCU1.P$18 | 35.5,42.21 34.28,42.21 MCU1.P$12 | 35.5,42.21 36.72,43.43 36.72,49.68 MCU1.P$63 | 41.14,44.42 43.2,42.36 43.2,38.32 MCU1.P$31 | 41.14,44.42 41.14,45.33 43.05,47.24 45.72,47.24 MCU1.P$47 | v38.55,41.83 41.14,44.42 | 10.97,35.96 10.97,36.8 GNSS1.P$20 | 10.97,35.96 10.97,34.36 GNSS1.P$19 | GNSS1.P$12 12.64,36.8 12.95,36.8 GNSS1.P$10 13.02,36.72 13.02,36.19 | 13.41,35.12 13.41,35.81 13.02,36.19 | 13.41,35.12 13.41,34.36 GNSS1.P$7 | 14.4,35.12 14.62,34.89 14.62,34.36 GNSS1.P$1 14.62,34.21 16.99,31.85 16.99,28.27 MOTORBAT.P$1 | 13.41,35.12 14.4,35.12 | 14.4,35.12 14.62,35.35 14.62,36.8 GNSS1.P$2 | 10.97,35.96 12.8,35.96 13.02,36.19 | v27.2,16.99 27.2,20.11 28.04,20.95 BNO1.P2
  Bottom 0.152: CN1.VSS 37.8,63.8 v38,64
  Bottom 0.229: 57.14,34.36 57.14,34.97 C5.1 | 57.14,34.36 57.14,32.08 C6.1 57.07,31.92 56.46,31.31 | 57.14,34.36 v54.71,34.36 | 56.46,31.31 54.71,29.56 54.71,29.03 IC1.4 | C8.1 57.83,7.01 57.83,7.92 53.87,11.88 53.87,21.18 52.04,23.01 52.04,25.9 51.05,26.89 D2.A 51.43,26.66 52.5,27.73 52.95,27.73 53.41,27.27 53.41,23.46 57.14,19.73 C7.1 57.22,14.93 57.98,14.17 59.05,14.17 | 56.46,31.31 58.52,29.26 58.52,24 59.74,22.78 59.74,14.4 59.51,14.17 59.05,14.17 | T2.E 15.16,20.95 15.23,21.03 20.72,21.03 24.68,17.06 24.84,17.06 C9.1 24.91,16.91 27.2,16.91 | 38.78,5.02 38.78,6.78 38.93,6.93 38.93,9.14 C12.1 38.86,9.21 38.17,9.21 32.3,15.08 29.41,15.08 27.58,16.91 27.2,16.91 | 38.78,5.02 40,3.8 JP2.8 39.7,4.26 40.88,5.44 | 40.88,5.44 41.22,5.79 41.22,6.62 41.98,7.39 41.98,9.14 C11.1 | JP2.14 32.38,3.8 33.52,3.8 34.67,4.95 38.7,4.95 38.78,5.02 | 40.88,5.44 42.52,3.8 JP2.6 42.59,3.88 43.51,4.8 45.49,4.8 46.17,4.11 46.17,3.65 47.16,2.66 48.08,2.66 49.83,4.41 57.22,4.41 59.05,6.24 59.05,14.17 | 60.27,53.03 54.4,47.16 49.07,47.16 C2.2 | 60.27,53.03 61.95,53.03 62.94,52.04 R8.1 | 60.27,53.03 55.77,57.53 55.77,62.17 JP1.2 | v17.9,57.6 17.9,58.97 R9.1 | 26.21,47.09 26.21,44.19 26.97,43.43 26.97,43.2 C4.1 27.05,43.05 28.19,41.91 28.8,41.91 | 26.21,47.09 26.97,47.85 C3.1 | 28.8,41.91 35.88,41.91 | 35.88,41.91 36.95,41.91 C1.2 37.1,41.83 v38.55,41.83 | v35.88,41.83 35.88,41.91 | 28.72,28.19 28.72,21.64 28.11,21.03 BNO1.P2 | 28.72,28.19 28.72,29.94 SJ2.1 28.8,30.09 28.8,41.91 | 28.72,28.19 17.06,28.19 MOTORBAT.P$1 | 26.21,47.09 19.05,54.25 17.06,54.25 BATTERY.P$1 | v27.2,16.99 27.2,16.91
GPIO1
  Top 0.229: MCU1.P$15 34.21,40.69 33.45,40.69 33.29,40.53 33.29,26.36 37.48,22.17 37.48,21.71 37.18,21.41 37.18,6.55 37.41,6.32 JP2.9
GPIO2
  Top 0.229: MCU1.P$41 45.79,44.27 48.53,44.27 57.07,35.73 57.07,28.27 41.22,12.42 41.22,5.79 40.23,4.8 38.48,4.8 37.48,3.8 JP2.10
GPIO3  (via drill 0.3)
  Top 0.229: v40.15,36.88 40.69,37.41 40.69,38.25 MCU1.P$26 | v35.5,22.25 34.67,21.41 34.67,15.92 36.42,14.17 36.42,7.77 34.97,6.32 JP2.11
  Bottom 0.229: v40.15,36.88 40.15,26.89 v35.5,22.25
GPIO4  (via drill 0.3)
  Top 0.229: v41.22,39.47 41.22,38.32 MCU1.P$27 | v36.8,21.94 36.8,7.08 35.96,6.24 35.96,4.8 34.97,3.8 JP2.12
  Bottom 0.229: v41.22,39.47 41.22,26.36 v36.8,21.94
GPS_RX  (via drill 0.3)
  Top 0.152: v12.64,33.22 13.25,32.61 13.79,32.61 14.17,32.99 14.17,34.28 GNSS1.P$3 | v12.64,40.84 13.02,40.84 25.29,53.11 34.74,53.11 v37.79,56.15 | v43.12,46.4 44.72,44.8 45.72,44.8 MCU1.P$42
  Bottom 0.152: v12.64,40.84 v12.64,33.22 | v37.79,56.15 37.79,59.13 38.17,59.51 38.63,59.51 43.12,55.01 v43.12,46.4
GPS_TX  (via drill 0.3)
  Top 0.152: v13.56,33.22 13.79,33.45 13.79,34.28 GNSS1.P$5 | v18.36,38.02 18.36,39.54 31.01,52.19 v37.33,52.19 | v44.57,45.79 45.11,45.26 45.72,45.26 MCU1.P$43
  Bottom 0.152: v18.36,38.02 v13.56,33.22 | v37.33,52.19 37.33,51.12 42.67,45.79 v44.57,45.79
IM_BSY  (via drill 0.3)
  Top 0.152: v54.94,33.45 56.23,32.15 56.23,31.62 IM1.$P1 | v53.49,36.57 52.57,36.57 46.4,42.74 45.79,42.74 MCU1.P$38
  Bottom 0.152: v54.94,33.45 54.78,33.45 53.49,34.74 v53.49,36.57
IM_RST
  Top 0.152: IM1.$P19 51.73,31.62 51.73,34.44 46.63,39.54 46.63,42.06 46.48,42.21 45.79,42.21 MCU1.P$37
IM_RX
  Top 0.152: IM1.$P6 55.32,35.43 55.32,33.9 56.69,32.53 56.69,29.71 53.11,26.13 43.28,26.13 34.28,35.12 34.28,40.23 MCU1.P$16
IM_ST_R  (via drill 0.3)
  Top 0.229: v52.8,33.67 52.8,31.62 IM1.$P15
  Bottom 0.229: v52.8,33.67 52.8,38.09 59.96,45.26 60.57,45.26 63.93,48.61 63.93,49.83 69.03,54.94 70.94,54.94 R17.2
IM_TX
  Top 0.152: IM1.$P7 54.71,31.54 54.71,28.19 52.95,26.44 43.43,26.44 35.43,34.44 35.43,37.48 36.19,38.25 MCU1.P$17
IMU_SCL
  Top 0.152: MCU1.P$58 39.24,49.75 39.24,50.9 38.55,51.58 34.28,51.58 34.21,51.66 30.93,51.66 28.04,48.76 28.04,36.88 31.54,33.37 31.54,21.94 30.63,21.03 BNO1.P3
  Bottom 0.152: R13.1 31.92,19.05 31.92,19.66 30.63,20.95 BNO1.P3
IMU_SDA  (via drill 0.3)
  Top 0.152: v38.32,50.97 38.7,50.59 38.7,49.75 MCU1.P$59 | v38.25,52.19 37.64,52.8 25.45,52.8 10.13,37.48 10.13,29.48 24.15,15.46 27.58,15.46 33.07,20.95 BNO1.P4
  Bottom 0.152: v38.32,50.97 38.32,52.12 v38.25,52.19 | R14.1 33.98,19.05 33.98,20.11 33.14,20.95 BNO1.P4
MOTOR1  (via drill 0.3)
  Top 0.457: v15.46,26.66 15.46,25.06 19.88,20.64 v24.07,20.64
  Bottom 0.457: v15.46,26.66 15.46,27.96 FET9.P$3 | v24.07,20.64 26.82,17.9 27.58,17.9 29.71,15.77 32.61,15.77 36.42,11.96 40.91,11.96 41.98,10.89 C11.2 42.21,10.82 43.05,9.98 43.05,7.62 42.59,7.16 42.59,6.32 JP2.5
MOTOR2  (via drill 0.3)
  Top 0.457: v15.84,22.7 16,22.7 23.85,14.85 31.62,14.85 v33.22,16.45 | v38.02,14.7 38.02,8.3 40,6.32 JP2.7
  Bottom 0.457: v15.84,22.7 15.46,23.08 15.46,24 FET8.P$3 | v33.22,16.45 36.27,16.45 v38.02,14.7 | C12.2 39.01,10.82 39.16,10.82 40.08,9.9 40.08,6.4 40,6.32 JP2.7
MTBATIN
  Bottom 0.457: 14.09,26.05 14.09,27.58 13.02,28.65 13.02,28.95 FET9.P$2 | 14.09,26.05 13.18,25.14 FET8.P$2 12.95,24.99 10.05,24.99 R26.2 10.05,25.22 10.05,27.05 R25.1 | MOTORBAT.P$2 16.99,25.75 14.4,25.75 14.09,26.05
MTGATE1  (via drill 0.3)
  Top 0.152: v36.34,35.73 36.34,36.19 37.03,36.88 37.56,36.88 38.25,37.56 MCU1.P$21 | v21.03,33.14 v30.93,33.14
  Bottom 0.152: v36.34,35.73 33.52,35.73 v30.93,33.14 | v21.03,33.14 19.96,32.08 R24.2
MTGATE2  (via drill 0.3)
  Top 0.152: v38.7,36.88 38.7,38.25 MCU1.P$22
  Bottom 0.152: v38.7,36.88 38.7,30.48 29.03,20.8 29.03,20.64 28.42,20.04 27.66,20.04 26.44,21.25 26.44,21.41 25.9,21.94 14.55,21.94 14.17,21.56 14.17,18.43 14.32,18.28 18.21,18.28 19.88,19.96 R23.2
NRST  (via drill 0.3)
  Top 0.152: v35.73,44.8 34.28,44.8 MCU1.P$7
  Bottom 0.152: v35.73,44.8 36.95,46.02 R2.2
OSCIN
  Top 0.152: Q1.1 31.66,45.75 MCU1.P$5
  Bottom 0.152: Q1.1 29,48.15 C3.2
OSCOUT
  Top 0.152: MCU1.P$6 30.25,45.25 29,44 Q1.2
  Bottom 0.152: Q1.2 27.74,44.85 C4.2
PB_FET_DIODE
  Bottom 0.229: FET7.P$1 28.95,10.97 27.27,9.29 25.98,9.29 25.83,9.44 25.83,9.9 24.76,10.97 22.02,10.97 FET6.P$2 21.94,11.04 15.08,17.9 13.33,17.9 8.07,23.16 8.07,50.97 8,51.05 | 12.42,57.07 13.94,57.07 FET3.P$1 14.02,57.14 15.84,58.97 16,58.97 R9.2 | 12.42,57.07 9.06,57.07 FET4.P$1 | 8,51.05 6.17,51.05 D3.A | 8,51.05 12.42,55.47 12.42,57.07
PBDET  (via drill 0.3)
  Top 0.152: v36.04,34.67 35.73,34.97 35.73,36.04 36.88,37.18 37.33,37.18 37.71,37.56 37.71,38.25 MCU1.P$20 | v29.41,28.04 29.41,20.95 27.81,19.35 27.81,16.53 v27.35,16.07
  Bottom 0.152: 27.08,14.97 28.04,14.02 R11.1 | 27.08,14.97 27.05,15.01 25.45,15.01 23.46,16.99 23.16,16.99 C9.2 | v29.41,28.04 v36.04,34.67 | v27.35,16.07 27.35,15.23 27.08,14.97
PBDET_FET_R
  Bottom 0.152: 26.55,12.38 24.99,13.94 R12.2 | 26.55,12.38 26.59,12.34 26.59,10.05 FET7.P$3 | R11.2 29.94,13.94 29.71,13.94 28.19,12.42 26.59,12.42 26.55,12.38
PBIN
  Bottom 0.229: FET6.P$3 24.45,9.98 24.68,9.98 28.34,6.32 32.38,6.32 JP2.13
PC13_R  (via drill 0.3)
  Top 0.229: v33.07,47.31 34.21,47.31 MCU1.P$2
  Bottom 0.229: v33.07,47.31 31.92,47.31 25.06,54.17 25.06,54.94 24.07,55.93 R4.1
PC14_R  (via drill 0.3)
  Top 0.229: v33.98,51.05 35.2,49.83 35.2,47.01 34.97,46.78 34.28,46.78 MCU1.P$3
  Bottom 0.229: v33.98,51.05 33.98,52.27 31.09,55.16 31.09,56.69 30.86,56.92 27.96,56.92 27.05,56 R5.1
PC15_R  (via drill 0.3)
  Top 0.229: v32.38,51.05 32.38,47.09 33.14,46.33 34.21,46.33 MCU1.P$4
  Bottom 0.229: v32.38,51.05 32.38,51.66 30.02,54.02 R6.1
R_LED1  (via drill 0.3)
  Top 0.229: v24,52.8 LED1.A
  Bottom 0.229: v24,52.8 24,54.02 R4.2
R_LED2  (via drill 0.3)
  Top 0.229: v28.27,53.72 28.04,53.95 27.05,53.95 LED2.A
  Bottom 0.229: v28.27,53.72 27.35,53.72 27.05,54.02 R5.2
R_LED3  (via drill 0.3)
  Top 0.229: v28.8,55.01 29.79,54.02 29.94,54.02 LED3.A
  Bottom 0.229: v28.8,55.01 29.03,55.01 29.94,55.93 R6.2
R_LED4  (via drill 0.3)
  Top 0.229: v71.01,51.81 71.01,52.88 LED4.A
  Bottom 0.229: v71.01,51.81 71.01,53.03 R17.1
R_LEDP  (via drill 0.3)
  Top 0.229: v32.76,54.94 33.67,54.02 33.98,54.02 LEDP.A
  Bottom 0.229: v32.76,54.94 32.99,54.94 33.98,55.93 R3.1
R_T1
  Bottom 0.152: T1.E 15.08,32.91 14.24,32.08 12.95,32.08 T1.C 12.87,32 12.87,31.85 10.05,29.03 R25.2 10.05,28.95 11.96,27.05 12.95,27.05 FET9.P$1
R_T2
  Bottom 0.152: R26.1 10.05,23.01 12.95,23.01 FET8.P$1 12.95,22.93 12.95,20.04 T2.C
SDIO0  (via drill 0.35)
  Top 0.152: MCU1.P$39 45.63,43.37 45.02,43.37 44.39,44 v44,44 | R21.1 v36,64.08
  Bottom 0.152: v44,44 36.7,51.3 CN1.DAT0 36.7,63.38 v36,64.08
SDIO1  (via drill 0.35)
  Top 0.152: MCU1.P$40 45.63,43.87 45.02,43.87 43.89,45 v42,45 | v35,64.08 33.03,66.05 R22.1
  Bottom 0.152: v42,45 35.6,51.4 CN1.DAT1 35.6,63.48 v35,64.08
SDIO2  (via drill 0.35)
  Top 0.152: v43.3,61.1 43.3,60 44,59.3 44,59.09 arc90 44.27,58.83 44.74,58.83 arc-90 45.01,58.56 45.01,58.5 arc-90 44.74,58.23 44.27,58.23 arc90 44,57.96 44,57.9 arc90 44.27,57.63 44.74,57.63 arc-90 45.01,57.37 45.01,57.3 arc-90 44.74,57.04 44.27,57.04 arc90 44,56.77 44,56.71 arc90 44.27,56.44 44.74,56.44 arc-90 45.01,56.17 45.01,56.11 arc-90 44.74,55.84 44.27,55.84 arc90 44,55.58 44,55.52 arc90 44.27,55.25 44.74,55.25 arc-90 45.01,54.98 45.01,54.92 arc-90 44.74,54.65 44.27,54.65 arc90 44,54.39 44,54.32 arc90 44.27,54.06 44.74,54.06 arc-90 45.01,53.79 45.01,53.73 arc-90 44.74,53.46 44.27,53.46 arc90 44,53.19 44,53.13 arc90 44.27,52.86 44.74,52.86 arc-90 45.01,52.6 45.01,52.53 arc-90 44.74,52.27 44.27,52.27 arc90 44,52 42.75,50.75 MCU1.P$51 | v43.99,64.01 45.96,64.01 R18.1
  Bottom 0.152: v43.3,61.1 CN1.DAT2 43.3,63.32 v43.99,64.01
SDIO3  (via drill 0.35)
  Top 0.152: v42.2,61 42.2,58.64 arc90 42.47,58.37 43.01,58.37 arc-90 43.27,58.11 43.27,58.08 arc-90 43.01,57.82 42.47,57.82 arc90 42.2,57.55 42.2,57.53 arc90 42.47,57.26 43.01,57.26 arc-90 43.27,57 43.27,56.97 arc-90 43.01,56.71 42.47,56.71 arc90 42.2,56.44 42.2,56.42 arc90 42.47,56.15 43.01,56.15 arc-90 43.27,55.88 43.27,55.86 arc-90 43.01,55.6 42.47,55.6 arc90 42.2,55.33 42.2,55.31 arc90 42.47,55.04 43.01,55.04 arc-90 43.27,54.77 43.27,54.75 arc-90 43.01,54.49 42.47,54.49 arc90 42.2,54.22 42.2,54.2 arc90 42.47,53.93 43.01,53.93 arc-90 43.27,53.66 43.27,53.64 arc-90 43.01,53.38 42.47,53.38 arc90 42.2,53.11 42.2,53.09 arc90 42.47,52.82 43.01,52.82 arc-90 43.27,52.55 43.27,52.53 arc-90 43.01,52.27 42.47,52.27 arc90 42.2,52 42.2,49.8 MCU1.P$52 | v42,64 44.05,66.05 R19.1
  Bottom 0.152: v42.2,61 CN1.CD/DAT3 42.2,63.8 v42,64
SDIOCLK  (via drill 0.35)
  Top 0.152: v41.59,59.1 41.75,58.94 41.75,58.88 arc-90 41.48,58.62 41.04,58.62 arc90 40.77,58.35 40.77,58.31 arc90 41.04,58.04 41.48,58.04 arc-90 41.75,57.77 41.75,57.73 arc-90 41.48,57.46 41.04,57.46 arc90 40.77,57.2 40.77,57.15 arc90 41.04,56.89 41.48,56.89 arc-90 41.75,56.62 41.75,56.57 arc-90 41.48,56.31 41.04,56.31 arc90 40.77,56.04 40.77,56 arc90 41.04,55.73 41.48,55.73 arc-90 41.75,55.46 41.75,55.42 arc-90 41.48,55.15 41.04,55.15 arc90 40.77,54.89 40.77,54.84 arc90 41.04,54.58 41.48,54.58 arc-90 41.75,54.31 41.75,54.27 arc-90 41.48,54 41.04,54 arc90 40.77,53.73 40.77,53.69 arc90 41.04,53.42 41.48,53.42 arc-90 41.75,53.16 41.75,53.11 arc-90 41.48,52.84 41.04,52.84 arc90 40.77,52.58 40.77,52.53 arc90 41.04,52.27 41.48,52.27 arc-90 41.75,52 MCU1.P$53
  Bottom 0.152: CN1.CLK 39.27,62.23 39.27,61.49 41.59,59.17 v41.59,59.1
SDIOCMD  (via drill 0.35)
  Top 0.152: MCU1.P$54 41.25,50.59 39.99,51.85 39.99,52 arc90 39.72,52.27 39.11,52.27 arc-90 38.84,52.53 38.84,52.62 arc-90 39.11,52.89 39.72,52.89 arc90 39.99,53.16 39.99,53.24 arc90 39.72,53.51 39.11,53.51 arc-90 38.84,53.78 38.84,53.87 arc-90 39.11,54.13 39.72,54.13 arc90 39.99,54.4 39.99,54.49 arc90 39.72,54.75 39.11,54.75 arc-90 38.84,55.02 38.84,55.11 arc-90 39.11,55.38 39.72,55.38 arc90 39.99,55.64 39.99,55.73 arc90 39.72,56 39.11,56 arc-90 38.84,56.27 38.84,56.35 arc-90 39.11,56.62 39.72,56.62 arc90 39.99,56.89 39.99,56.98 arc90 39.72,57.24 39.11,57.24 arc-90 38.84,57.51 38.84,57.6 arc-90 39.11,57.86 39.72,57.86 arc90 39.99,58.13 39.99,58.35 41.1,59.47 v41.1,61 | R20.1 42,65 v41,64
  Bottom 0.152: v41.1,61 CN1.CMD 41.1,63.9 v41,64
SIGNAL3V3  (via drill 0.3)
  Top 0.152: v29.03,10.05 29.03,11.2 29.06,11.23 | 33.75,15.92 34.06,16.23 v34.06,21.79 33.9,21.94 32.69,21.94 32.15,21.41 32.15,21.18 31.01,20.04 30.17,20.04 29.94,20.26 v29.56,20.26 | 33.75,15.92 29.06,11.23 | U$1.P$5 19.96,64.46 19.96,61.87 9.82,51.73 9.82,27.66 26.21,11.27 29.03,11.27 29.06,11.23 | 33.75,15.92 v35.73,13.94
  Bottom 0.152: 49.98,10.97 48.08,10.97 R15.2 47.92,10.97 45.03,10.97 R10.2 44.95,10.97 43.51,10.97 40.53,13.94 v35.73,13.94 | 49.98,10.97 50.97,10.97 R16.2 | 49.98,10.97 49.98,17.22 SJ1.2 | v29.03,10.05 29.03,9.06 FET7.P$2 | v34.06,21.79 34.06,20.87 35.88,19.05 R14.2 | v29.56,20.26 30.02,19.81 30.02,19.05 R13.2
SIGNALGND  (via drill 0.3)
  Top 0.152: v23.08,8.99 v23.08,11.65 | v37.26,36.27 40.38,36.27 41.68,37.56 41.68,38.25 MCU1.P$28 | v29.48,32.53 29.33,32.53 v28.11,31.31 27.05,30.25 27.05,21.18 23.92,18.05 v22.78,18.05 | v19.05,60.12 19.05,59.58 13.94,54.48 v13.94,51.96
  Bottom 0.152: FET6.P$1 22.02,8.99 v23.08,8.99 25.14,8.99 31.39,2.74 44.04,2.74 45.03,3.73 JP2.4 | v23.08,11.65 23.08,13.94 R12.1 23.01,14.02 23.01,15.77 22.32,16.45 22.32,17.6 v22.78,18.05 | v37.26,36.27 36.65,36.27 36.57,36.34 33.29,36.34 v29.48,32.53 | v28.11,31.31 27.05,30.25 SJ2.2 27.2,30.02 12.04,45.18 12.04,49.98 FET5.P$1 12.04,50.06 v13.94,51.96 | v19.05,60.12 22.93,64 R1.1
SWCLK
  Top 0.152: MCU1.P$49 43.81,49.75 45.79,49.75 58.21,62.17 JP1.3
SWDIO
  Top 0.152: MCU1.P$46 45.79,46.78 47.77,46.78 60.8,59.81 60.8,62.17 JP1.4
T1_BASE
  Bottom 0.152: T1.B 15.16,31.09 17.06,31.09 17.98,32 R24.1
T2_BASE
  Bottom 0.152: T2.B 15.16,19.12 17.14,19.12 17.98,19.96 R23.1
USB_FET_FET
  Bottom 0.229: FET1.P$3 62.4,45.03 67.36,45.03 FET2.P$3
USBDM  (via drill 0.3)
  Top 0.152: v63.01,39.92 57.22,45.72 45.79,45.72 MCU1.P$44 | v69.19,39.92 69.87,39.24 70.71,39.24 X1.2
  Bottom 0.152: v69.19,39.92 v63.01,39.92
USBDP  (via drill 0.3)
  Top 0.152: 68.61,41.33 69.95,40 X1.3 | 68.61,41.33 62.71,47.24 60.8,47.24 59.89,46.33 45.79,46.33 MCU1.P$45 | 68.61,41.33 v69.19,41.91
  Bottom 0.152: v69.19,41.91 70.1,40.99 75.97,40.99 R7.2
USBIN  (via drill 0.3)
  Top 0.229: 65.22,42.97 69.72,38.48 70.71,38.48 X1.1 | 65.22,42.97 65.15,43.05 v60.73,43.05 61.03,43.12 v61.03,46.63 | v65.3,43.05 65.22,42.97
  Bottom 0.229: R7.1 75.97,39.09 71.09,39.09 66.21,43.96 65.07,43.96 FET2.P$1 65.3,43.89 v65.3,43.05 | R8.2 61.11,51.96 61.11,49.07 D1.A 61.03,48.91 v61.03,46.63 | v60.73,43.05 60.04,43.73 60.04,43.96 FET1.P$1

### Text on the board
tNames: 3V3 / GND / SWCLK / SWDIO | 1 0 | GND / BAT | GND / MTR | GND/PBIN / / GPIO4/GPIO3 / / GPIO2/GPIO1 / / GND/MTR2 / / GND/MTR1 / / SGND/S3V3 / / SDA/SCL | OFF ON